# Altium project ProyectoMulticapa.PrjPcb (part 2 of 3)

## Sheet [4] Power Management.SchDoc
size Letter; Author: Ángel O. , Victor V.; DocumentNumber: 4; Revision: 1.0; SheetNumber: 4; SheetTotal: 6
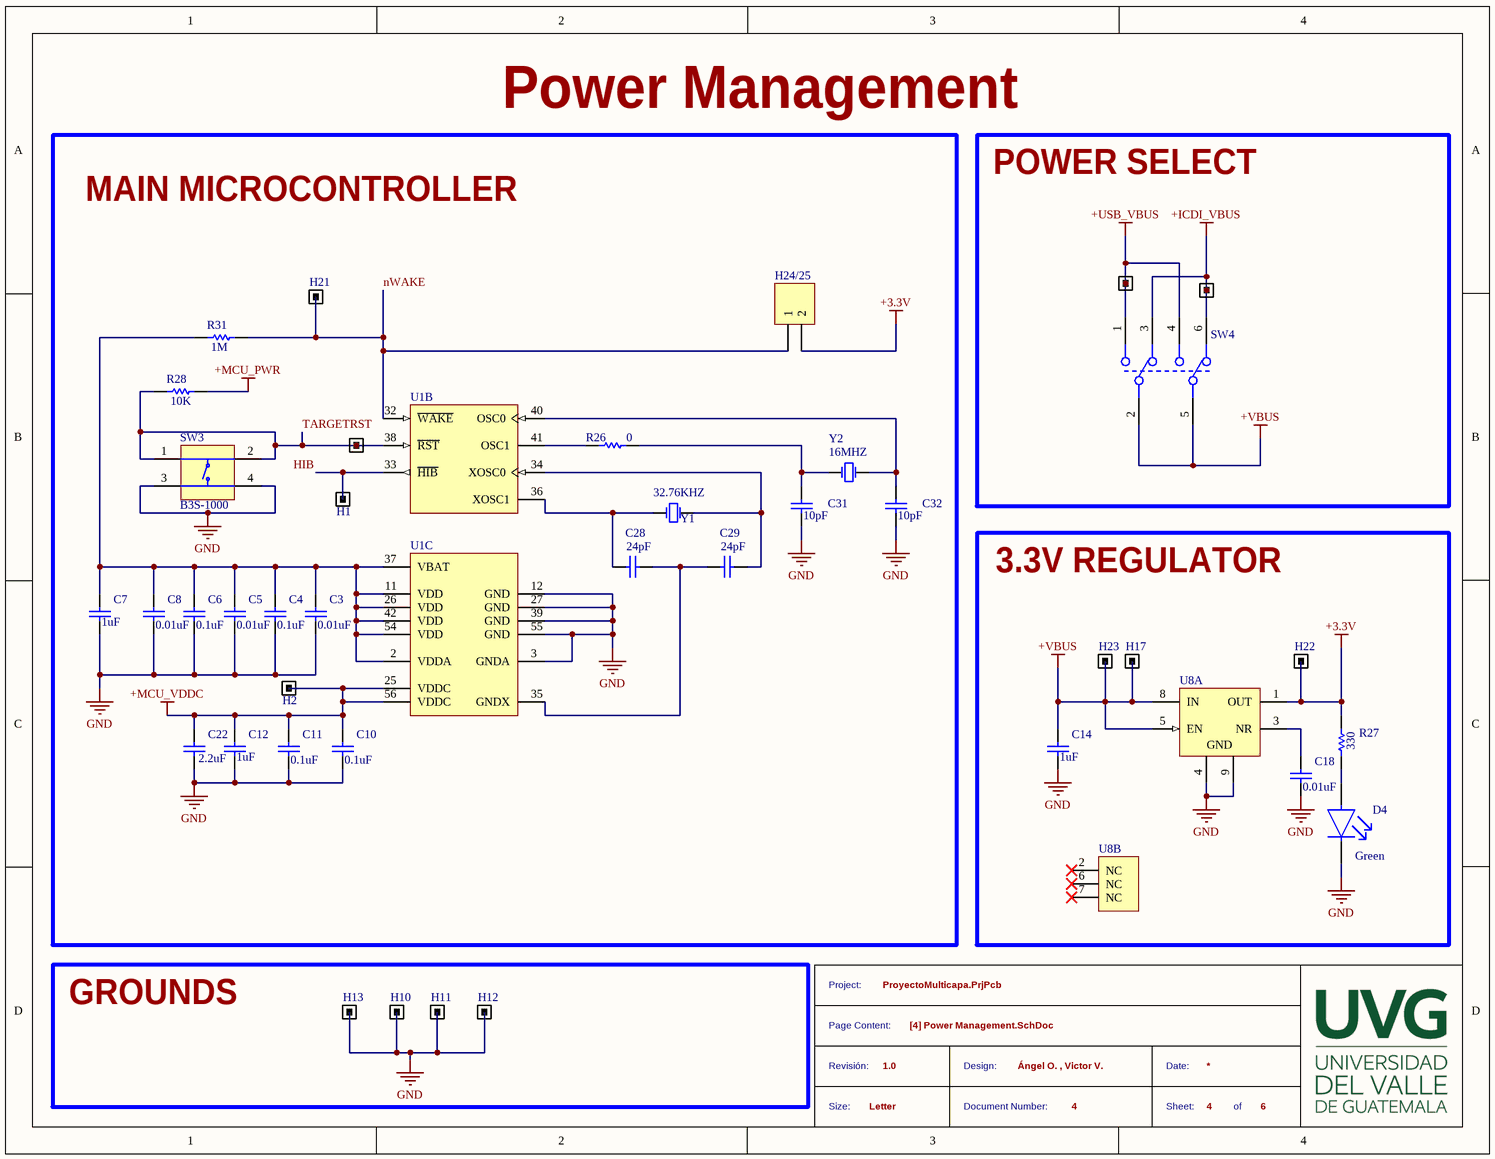
[diagram p4: [4] Power Management.SchDoc]

### Parts
C3  EMK105B7103KV-F  [CAPC1005]  (value not drawn)
C4  EMK105B7104KV-F  [CAPC1005]  (value not drawn)
C5  EMK105B7103KV-F  [CAPC1005]  (value not drawn)
C6  EMK105B7104KV-F  [CAPC1005]  (value not drawn)
C7  capacitor Johanson Dielectrics Inc  [C0402 imperial]  (value not drawn)
C8  EMK105B7103KV-F  [CAPC1005]  (value not drawn)
C10  EMK105B7104KV-F  [CAPC1005]  (value not drawn)
C11  EMK105B7104KV-F  [CAPC1005]  (value not drawn)
C12  capacitor Johanson Dielectrics Inc  [C0402 imperial]  (value not drawn)
C14  capacitor Johanson Dielectrics Inc  [C0402 imperial]  (value not drawn)
C18  EMK105B7103KV-F  [CAPC1005]  (value not drawn)
C22  GRM188R61C225KE15D  [CAPC1608X90X35LL10T15]  (value not drawn)
C28  Capacitor  [C0402 imperial]  (value not drawn)
C29  Capacitor  [C0402 imperial]  (value not drawn)
C31  GRM1555C1H100JZ01D  [CAPC1005X55X25LL05T10]  (value not drawn)
C32  GRM1555C1H100JZ01D  [CAPC1005X55X25LL05T10]  (value not drawn)
D4  Green  [FP-LTST-C171GKT-MFG]
H1  header  [HEADER 1]  (value not drawn)
H2  header  [HEADER 1]  (value not drawn)
H10  header  [HEADER 1]  (value not drawn)
H11  header  [HEADER 1]  (value not drawn)
H12  header  [HEADER 1]  (value not drawn)
H13  header  [HEADER 1]  (value not drawn)
H17  header  [HEADER 1]  (value not drawn)
H18  header  [HEADER 1]  (value not drawn)
H19  header  [HEADER 1]  (value not drawn)
H20  header  [HEADER 1]  (value not drawn)
H21  header  [HEADER 1]  (value not drawn)
H22  header  [HEADER 1]  (value not drawn)
H23  header  [HEADER 1]  (value not drawn)
H24/25  Header 2  [HDR1X2]  (value not drawn)
R26  ERJ-3GEY0R00V  [FP-ERJ-3GEY0R00V-IPC_A]  (value not drawn)
R27  RC0402FR-07330RL  [RESC1005X40X25LL05T10]  (value not drawn)
R28  RC0402FR-0710KL  [RESC1005X40X25LL05T10]  (value not drawn)
R31  MCR01MRTF1004  [RESC1005X40X25LL05T10]  (value not drawn)
SW3  B3S-1000  [OMRON-B3S-1000-4_V]
SW4  JS202011SCQN  [FP-JS202011SCQN-MFG]  (value not drawn)
U1  TM4C123GH6PMIR  [PM0064A_L]  (value not drawn)  (parts B,C of 3)
U8  TPS73633DRBT  [DRB0008A_V]  (value not drawn)  (parts A,B of 2)
Y1  AB26TRB-32.768KHZ-T  [AB26TRB]  (value not drawn)
Y2  NX5032GA-16.000000MHZ  [NX5032GA16000000MHZLNCD1]  (value not drawn)

### Blocks framed on the sheet
MAIN MICROCONTROLLER: C3-C8 C10-C12 C22 C28 C29 C31 C32 H1 H2 H20 H21 H24/25 R26 R28 R31 SW3 U1 Y1 Y2
POWER SELECT: H18 H19 SW4
3.3V REGULATOR: C14 C18 D4 H17 H22 H23 R27 U8
GROUNDS: H10-H13

### Nets
+3.3V: H22.1 H24/25.2 R27.2 U8.1(OUT)
+ICDI_VBUS: H19.1 SW4.3 SW4.6
+MCU_PWR: R28.2
+MCU_VDDC: C10.1 C11.1 C12.1 C22.1 H2.1 U1.25(VDDC) U1.56(VDDC)
+USB_VBUS: H18.1 SW4.1 SW4.4
+VBUS: C14.1 H17.1 H23.1 SW4.2 SW4.5 U8.5(EN) U8.8(IN)
GND: C3.2 C4.2 C5.2 C6.2 C7.2 C8.2 C10.2 C11.2 C12.2 C14.2 C18.2 C22.2 C31.2 C32.2 D4.1(C) H10.1 H11.1 H12.1 H13.1 SW3.3 SW3.4 U1.3(GNDA) U1.12(GND) U1.27(GND) U1.39(GND) U1.55(GND) U8.4(GND) U8.9(GND)
HIB: H1.1 U1.33(~{HIB})
nWAKE: H21.1 H24/25.1 R31.2 U1.32(~{WAKE})
TARGETRST: H20.1 R28.1 SW3.1 SW3.2 U1.38(~{RST})
NetC3_1: C3.1 C4.1 C5.1 C6.1 C7.1 C8.1 R31.1 U1.2(VDDA) U1.11(VDD) U1.26(VDD) U1.37(VBAT) U1.42(VDD) U1.54(VDD)
NetC18_1: C18.1 U8.3(NR)
NetC28_1: C28.1 U1.36(XOSC1) Y1.1
NetC28_2: C28.2 C29.1 U1.35(GNDX)
NetC29_2: C29.2 U1.34(XOSC0) Y1.2
NetC31_1: C31.1 R26.2 Y2.1
NetC32_1: C32.1 U1.40(OSC0) Y2.2
NetD4_2: D4.2(A) R27.1
NetR26_1: R26.1 U1.41(OSC1)

Not connected (* = marked no-connect by the designer): U8 2(NC)* 6(NC)* 7(NC)*

### Notes on the sheet
- Power Management
- Project:
- Page Content:
- Revisión:
- Size:
- Letter
- Design:
- Document Number:
- Date:
- Sheet:
- of
- (in symbol AB26TRB-32.768KHZ-T) 32.76KHZ
- (in symbol EMK105B7103KV-F) 0.01uF
- (in symbol EMK105B7104KV-F) 0.1uF
- (in symbol ERJ-3GEY0R00V) 0
- (in symbol MCR01MRTF1004) 1M
- (in symbol NX5032GA-16.000000MHZ) 16MHZ
- (in symbol RC0402FR-0710KL) 10K
- (in symbol RC0402FR-07330RL) 330

### Library data of the parts
C3 C5 C8 C18 = EMK105B7103KV-F: TAIYO YUDEN   EMK105B7103KV-F   CERAMIC CAPACITOR, 0.01UF, 16V, X7R, 10%, 0402, FULL REEL; Capacitance: 10nF; Supplier 1: Digi-Key; Manufacturer: Taiyo Yuden; Manufacturer Part Number: EMK105B7103KV-F; Stock 1: 171674; Pricing 1: 1 = 0.10000, 10 = 0.02500, 50 = 0.01380, 100 = 0.01130, 500 = 0.00804, 1000 = 0.00632, 2500 = 0.00575, 5000 = 0.00529 (USD); RoHS: Yes; Mount: Surface Mount; Case/Package: 0402; Number of Pins: 2; Case Code (Metric): 1005; Case Code (Imperial): 0402; Contact Plating: Tin; Min Operating Temperature: -55°C; Max Operating Temperature: 125°C; Package Quantity: 1; Voltage Rating: 16V; Tolerance: 10%; Packaging: Tape and Reel; Voltage Rating (DC): 16V; Dielectric: X7R; Termination: SMD/SMT; Series: M; Construction: Flat; Resistor Type: Ceramic; Length: 1mm; Width: 0.02inch; Height: 0.5mm; Thickness: 0.022inch; Depth: 0.5mm; Radiation Hardening: No; REACH SVHC: Unknown; RoHS Compliant: Yes; ComponentLink1URL: https://datasheet.ciiva.com/156/mlcc-all-e-156078.pdf?src-supplier=Digi-Key; ComponentLink1Description: https://datasheet.ciiva.com/156/mlcc-all-e-156078.pdf?src-supplier=Digi-Key; ComponentLink2URL: https://datasheet.ciiva.com/156/mlcc-all-e-156079.pdf?src-supplier=Digi-Key; ComponentLink2Description: https://datasheet.ciiva.com/156/mlcc-all-e-156079.pdf?src-supplier=Digi-Key; ComponentLink3URL: https://datasheet.ciiva.com/156/mlcc-all-e-156080.pdf?src-supplier=Digi-Key; ComponentLink3Description: https://datasheet.ciiva.com/156/mlcc-all-e-156080.pdf?src-supplier=Digi-Key; ComponentLink4URL: https://datasheet.ciiva.com/11596/mlcc01-e-11596553.pdf?src-supplier=Avnet; ComponentLink4Description: https://datasheet.ciiva.com/11596/mlcc01-e-11596553.pdf?src-supplier=Avnet; ComponentLink5URL: https://datasheet.ciiva.com/28644/746258-28644943.pdf?src-supplier=Element14; ComponentLink5Description: https://datasheet.ciiva.com/28644/746258-28644943.pdf?src-supplier=Element14; ComponentLink6URL: https://datasheet.ciiva.com/7975/1481447-7975594.pdf?src-supplier=Element14; ComponentLink6Description: https://datasheet.ciiva.com/7975/1481447-7975594.pdf?src-supplier=Element14; Supplier Part Number 1: 587-2708-1-ND
C4 C6 C10 C11 = EMK105B7104KV-F: TAIYO YUDEN - EMK105B7104KV-F - SMD Multilayer Ceramic Capacitor, 0.1 &#181;F, 16 V, 0402 [1005 Metric], &#177; 10%, X7R, M Series; Capacitance: 100nF; Voltage Rating (DC): 16V; Supplier 1: Digi-Key; Manufacturer: Taiyo Yuden; Manufacturer Part Number: EMK105B7104KV-F; Stock 1: 5046270; Pricing 1: 1 = 0.10000, 10 = 0.02400, 50 = 0.01320, 100 = 0.01070, 500 = 0.00764, 1000 = 0.00601, 2500 = 0.00546, 5000 = 0.00503 (USD); RoHS: Yes; Mount: Surface Mount; Case/Package: 0402; Number of Pins: 2; Case Code (Metric): 1005; Case Code (Imperial): 0402; Min Operating Temperature: -55°C; Max Operating Temperature: 125°C; Tolerance: 10%; Packaging: Tape and Reel; Dielectric: X7R; Package Quantity: 1; Voltage Rating: 16V; Termination: SMD/SMT; Series: M; Construction: Flat; Resistor Type: Ceramic; Length: 1mm; Width: 0.02inch; Height: 0.5mm; Thickness: 0.022inch; Depth: 0.5mm; Radiation Hardening: No; Halogen Free: Halogen Free; REACH SVHC: Unknown; RoHS Compliant: Yes; Lead Free: Lead Free; ComponentLink1URL: https://datasheet.ciiva.com/129/emk105b7104kv-f-ss-129714.pdf?src-supplier=Digi-Key; ComponentLink1Description: https://datasheet.ciiva.com/129/emk105b7104kv-f-ss-129714.pdf?src-supplier=Digi-Key; ComponentLink2URL: https://datasheet.ciiva.com/30227/emk105b7104kv-f-30227394.pdf?src-supplier=Onlinecomponents.com; ComponentLink2Description: https://datasheet.ciiva.com/30227/emk105b7104kv-f-30227394.pdf?src-supplier=Onlinecomponents.com; ComponentLink3URL: https://datasheet.ciiva.com/22748/746258-22748959.pdf?src-supplier=Element14; ComponentLink3Description: https://datasheet.ciiva.com/22748/746258-22748959.pdf?src-supplier=Element14; Supplier Part Number 1: 587-1451-1-ND
C7 C12 C14 = 100R07X105KV4T: Cap Ceramic 1uF 10V X5R 10% SMD 0402 85C T/R; Supplier 1: Mouser; Manufacturer: Johanson; Manufacturer Part Number: 100R07X105KV4T; Stock 1: 173156; Pricing 1: 1 = 0.26000, 10 = 0.13400, 50 = 0.13400, 100 = 0.07600, 1000 = 0.04900, 10000 = 0.04000 (USD); RoHS: Yes; Mount: Surface Mount; Case/Package: 0402; Number of Pins: 2; Case Code (Metric): 1005; Case Code (Imperial): 0402; Weight: 2.3E-05oz; Min Operating Temperature: -55°C; Max Operating Temperature: 85°C; Capacitance: 1uF; Tolerance: 10%; Voltage Rating: 10V; Packaging: Tape and Reel; Package Quantity: 10000; Voltage Rating (DC): 10V; Dielectric: X5R; Termination: SMD/SMT; Series: TANCERAM®; Length: 1.02mm; Width: 0.02inch; Height: 0.64mm; Thickness: 0.025inch; Depth: 0.51mm; Radiation Hardening: No; REACH SVHC: No SVHC; RoHS Compliant: Yes; ComponentLink1URL: https://datasheet.ciiva.com/26948/getdatasheetpartid-789067-26948543.pdf?src-supplier=Verical; ComponentLink1Description: https://datasheet.ciiva.com/26948/getdatasheetpartid-789067-26948543.pdf?src-supplier=Verical; ComponentLink2URL: https://datasheet.ciiva.com/22693/jdi-full-catalog-2012-01-22693744.pdf?src-supplier=Element14; ComponentLink2Description: https://datasheet.ciiva.com/22693/jdi-full-catalog-2012-01-22693744.pdf?src-supplier=Element14; Supplier Part Number 1: 605-100R07X105KV4T
C22 = GRM188R61C225KE15D: Cap Ceramic 2.2uF 16V X5R 10% SMD 0603 85C Paper T/R; Manufacturer: Murata; Supplier 1: Farnell; Manufacturer Part Number: GRM188R61C225KE15D; Stock 1: 0; Pricing 1: 10 = 0.13600, 100 = 0.08010, 500 = 0.05040, 1000 = 0.04260, 2000 = 0.03240 (GBP); RoHS: Yes; Mount: Surface Mount; Case/Package: 0603; Case Code (Imperial): 0603; Case Code (Metric): 1608; Material: Ceramic; Min Operating Temperature: -55°C; Max Operating Temperature: 85°C; Capacitance: 2.2uF; Tolerance: 10%; Dielectric: X5R; Voltage Rating: 16V; Voltage Rating (DC): 16V; Packaging: Tape and Reel; Package Quantity: 1; Termination: SMD/SMT; Voltage: 16V; Length: 1.6mm; Width: 0.8mm; Height: 0.8mm; Thickness: 0.035inch; Depth: 0.8mm; Radiation Hardening: No; RoHS Compliant: Yes; Lead Free: Lead Free; REACH SVHC: No SVHC; ComponentLink1URL: https://datasheet.ciiva.com/135/grm188r61c225ke15-01-135062.pdf?src-supplier=Digi-Key; ComponentLink1Description: https://datasheet.ciiva.com/135/grm188r61c225ke15-01-135062.pdf?src-supplier=Digi-Key; ComponentLink2URL: https://datasheet.ciiva.com/135/grm188r61c225ke15-01-135063.pdf?src-supplier=Digi-Key; ComponentLink2Description: https://datasheet.ciiva.com/135/grm188r61c225ke15-01-135063.pdf?src-supplier=Digi-Key; ComponentLink3URL: https://datasheet.ciiva.com/5417/product-5417088.pdf?src-supplier=Mouser; ComponentLink3Description: https://datasheet.ciiva.com/5417/product-5417088.pdf?src-supplier=Mouser; ComponentLink4URL: https://datasheet.ciiva.com/3777/147grm188r61c225ke1523-3777042.pdf?src-supplier=Arrow+Electronics; ComponentLink4Description: https://datasheet.ciiva.com/3777/147grm188r61c225ke1523-3777042.pdf?src-supplier=Arrow+Electronics; ComponentLink5URL: https://datasheet.ciiva.com/29199/454457-da-01-en-vs-kondensator-0603-29199689.pdf?src-supplier=Conrad; ComponentLink5Description: https://datasheet.ciiva.com/29199/454457-da-01-en-vs-kondensator-0603-29199689.pdf?src-supplier=Conrad; ComponentLink6URL: https://datasheet.ciiva.com/135/grm188r61c225ke15-01-135061.pdf?src-supplier=Digi-Key; ComponentLink6Description: https://datasheet.ciiva.com/135/grm188r61c225ke15-01-135061.pdf?src-supplier=Digi-Key; ComponentLink7URL: https://datasheet.ciiva.com/16369/product-16369274.pdf?src-supplier=Future+Electronics; ComponentLink7Description: https://datasheet.ciiva.com/16369/product-16369274.pdf?src-supplier=Future+Electronics; Supplier Part Number 1: 1735526
C28 C29 = C1005C0G1H240J: CAP CER 24PF 50V C0G 0402; Manufacturer: TDK; Dielectric Material: Ceramic; Tolerance: 5%; Supplier 1: Newark; Manufacturer Part Number: C1005C0G1H240J; Stock 1: 0; RoHS: Yes; Mount: Surface Mount; Case/Package: 0402; Number of Pins: 2; Case Code (Metric): 1005; Case Code (Imperial): 0402; Min Operating Temperature: -55°C; Max Operating Temperature: 125°C; Package Quantity: 1; Capacitance: 24pF; Voltage Rating: 50V; Packaging: Tape and Reel; Voltage Rating (DC): 50V; Dielectric: C0G; Termination: SMD/SMT; Resistor Type: Ceramic; Series: C; Construction: Flat; Length: 0.039inch; Width: 0.02inch; Height: 0.5mm; Thickness: 0.022inch; ComponentLink1URL: https://datasheet.ciiva.com/161/c-series-generalappl-b11-161778.pdf?src-supplier=Digi-Key; ComponentLink1Description: https://datasheet.ciiva.com/161/c-series-generalappl-b11-161778.pdf?src-supplier=Digi-Key; ComponentLink2URL: https://datasheet.ciiva.com/161/c-series-generalappl-b11-161779.pdf?src-supplier=Digi-Key; ComponentLink2Description: https://datasheet.ciiva.com/161/c-series-generalappl-b11-161779.pdf?src-supplier=Digi-Key; ComponentLink3URL: https://datasheet.ciiva.com/161/c-series-generalappl-b11-161780.pdf?src-supplier=Digi-Key; ComponentLink3Description: https://datasheet.ciiva.com/161/c-series-generalappl-b11-161780.pdf?src-supplier=Digi-Key; ComponentLink4URL: https://datasheet.ciiva.com/5418/mlcc-commercial-general-en-5418382.pdf?src-supplier=Mouser; ComponentLink4Description: https://datasheet.ciiva.com/5418/mlcc-commercial-general-en-5418382.pdf?src-supplier=Mouser; Supplier Part Number 1: 87R3204
C31 C32 = GRM1555C1H100JZ01D: CAP, CERAMIC, 10PF, 50V, C0G/NP0, 0402; Manufacturer: Murata; Tolerance: 5%; Dielectric: C0G; Insulation Resistance: 10GR; Temperature Coefficient: 30ppm/°C; Supplier 1: Farnell; Manufacturer Part Number: GRM1555C1H100JZ01D; Stock 1: 0; Pricing 1: 1 = 37.68000, 3 = 28.53000 (GBP); RoHS: Yes; Mount: Surface Mount; Case/Package: 0402; Number of Pins: 2; Case Code (Imperial): 0402; Case Code (Metric): 1005; Dielectric Material: Ceramic; Min Operating Temperature: -55°C; Max Operating Temperature: 125°C; Capacitance: 10pF; Voltage Rating: 50V; Voltage Rating (DC): 50V; Packaging: Tape and Reel; Package Quantity: 1; Termination: SMD/SMT; Voltage: 50V; Series: GRM; Construction: Flat; Length: 1mm; Width: 0.5mm; Height: 0.5mm; Thickness: 0.022inch; Depth: 0.5mm; Size: 0.5mm; Radiation Hardening: No; REACH SVHC: No SVHC; Lead Free: Lead Free; RoHS Compliant: Yes; ComponentLink1URL: https://datasheet.ciiva.com/129/partnumbering-e-01-129819.pdf?src-supplier=Digi-Key; ComponentLink1Description: https://datasheet.ciiva.com/129/partnumbering-e-01-129819.pdf?src-supplier=Digi-Key; ComponentLink2URL: https://datasheet.ciiva.com/129/partnumbering-e-01-129820.pdf?src-supplier=Digi-Key; ComponentLink2Description: https://datasheet.ciiva.com/129/partnumbering-e-01-129820.pdf?src-supplier=Digi-Key; ComponentLink3URL: https://datasheet.ciiva.com/129/partnumbering-e-01-129821.pdf?src-supplier=Digi-Key; ComponentLink3Description: https://datasheet.ciiva.com/129/partnumbering-e-01-129821.pdf?src-supplier=Digi-Key; ComponentLink4URL: https://datasheet.ciiva.com/19476/1855887-19476237.pdf?src-supplier=Jameco; ComponentLink4Description: https://datasheet.ciiva.com/19476/1855887-19476237.pdf?src-supplier=Jameco; ComponentLink5URL: https://datasheet.ciiva.com/18184/getdatasheetpartid-91958-18184166.pdf?src-supplier=Verical; ComponentLink5Description: https://datasheet.ciiva.com/18184/getdatasheetpartid-91958-18184166.pdf?src-supplier=Verical; ComponentLink6URL: https://datasheet.ciiva.com/11787/0900766b807a1cab-11787097.pdf?src-supplier=RSComponents; ComponentLink6Description: https://datasheet.ciiva.com/11787/0900766b807a1cab-11787097.pdf?src-supplier=RSComponents; ComponentLink7URL: https://datasheet.ciiva.com/6068/1747431-6068159.pdf?src-supplier=Farnell; ComponentLink7Description: https://datasheet.ciiva.com/6068/1747431-6068159.pdf?src-supplier=Farnell; ComponentLink8URL: https://datasheet.ciiva.com/11607/c02e-11607480.pdf?src-supplier=Avnet; ComponentLink8Description: https://datasheet.ciiva.com/11607/c02e-11607480.pdf?src-supplier=Avnet; ComponentLink9URL: https://datasheet.ciiva.com/14116/grmseries-tc-hitype-eng-14116856.pdf?src-supplier=Distrelec; ComponentLink9Description: https://datasheet.ciiva.com/14116/grmseries-tc-hitype-eng-14116856.pdf?src-supplier=Distrelec; ComponentLink10URL: https://datasheet.ciiva.com/14116/grmseries-tc-hitype-eng-14116917.pdf?src-supplier=Distrelec; ComponentLink10Description: https://datasheet.ciiva.com/14116/grmseries-tc-hitype-eng-14116917.pdf?src-supplier=Distrelec; ComponentLink11URL: https://datasheet.ciiva.com/7828/1747431-7828813.pdf?src-supplier=Element14; ComponentLink11Description: https://datasheet.ciiva.com/7828/1747431-7828813.pdf?src-supplier=Element14; ComponentLink12URL: https://datasheet.ciiva.com/7828/1747431-7828815.pdf?src-supplier=Element14; ComponentLink12Description: https://datasheet.ciiva.com/7828/1747431-7828815.pdf?src-supplier=Element14; Supplier Part Number 1: 1118131
D4 = LTST-C171GKT: LED GREEN CLEAR CHIP SMD; Manufacturer: Vishay Lite-On; Luminous Intensity: 12mcd; Lens Color: Colorless; Dominant Wavelength: 569nm; Number of LEDs: 1; Power Dissipation: 100mW; Viewing Angle: 130°; Reverse Voltage: 5V; Test Current: 10mA; Forward Voltage: 2.1V; Wavelength: 585nm; Lens Style: Diffused; Forward Current: 30mA; Height: 0.8mm; Mount: Surface Mount; Package Quantity: 1; Length: 2mm; Case Code (Metric): 2012; Number of Pins: 2; Number of Elements: 1; Packaging: Tape and Reel; Color: Green; Min Operating Temperature: -55°C; Case/Package: 0805; Power Rating: 100mW; Max Operating Temperature: 85°C; Radiation Hardening: No; Depth: 1.25mm; Lens Transparency: Clear; Width: 1.25mm; Lead Free: Lead Free; Case Code (Imperial): 0805; Illumination Color: Green; Supplier 1: Digi-Key; Manufacturer Part Number: LTST-C171GKT; Stock 1: 10; Pricing 1: 1 = 0.26000, 10 = 0.14100, 100 = 0.06560, 500 = 0.06060, 1000 = 0.04747 (USD); RoHS: Yes; Series: CHIPLED 0805; RoHS Compliant: Yes; ComponentLink1URL: https://datasheet.ciiva.com/12400/lite-on-ltst-c171gkt-190133-12400647.pdf?src-supplier=Mouser; ComponentLink1Description: https://datasheet.ciiva.com/12400/lite-on-ltst-c171gkt-190133-12400647.pdf?src-supplier=Mouser; ComponentLink2URL: https://datasheet.ciiva.com/2110/ltst-c171gkt-2110000.pdf?src-supplier=Digi-Key; ComponentLink2Description: https://datasheet.ciiva.com/2110/ltst-c171gkt-2110000.pdf?src-supplier=Digi-Key; ComponentLink3URL: https://datasheet.ciiva.com/11773/0900766b80dc0296-11773991.pdf?src-supplier=RSComponents; ComponentLink3Description: https://datasheet.ciiva.com/11773/0900766b80dc0296-11773991.pdf?src-supplier=RSComponents; ComponentLink4URL: https://datasheet.ciiva.com/2110/ltst-c171gkt-2110001.pdf?src-supplier=Digi-Key; ComponentLink4Description: https://datasheet.ciiva.com/2110/ltst-c171gkt-2110001.pdf?src-supplier=Digi-Key; ComponentLink5URL: https://datasheet.ciiva.com/2110/ltst-c171gkt-2110002.pdf?src-supplier=Digi-Key; ComponentLink5Description: https://datasheet.ciiva.com/2110/ltst-c171gkt-2110002.pdf?src-supplier=Digi-Key; ComponentLink6URL: https://datasheet.ciiva.com/16396/ltst-c171gkt-16396549.pdf?src-supplier=Future+Electronics; ComponentLink6Description: https://datasheet.ciiva.com/16396/ltst-c171gkt-16396549.pdf?src-supplier=Future+Electronics; Supplier Part Number 1: 160-1423-1-ND
H1 H2 H10-H13 H17-H23 = header: Pads header que aparecen en la tiva
H24/25 = Header 2: Header, 2-Pin; LatestRevisionDate: 17-Jul-2002; LatestRevisionNote: Re-released for DXP Platform.; Publisher: Altium Limited
R26 = ERJ-3GEY0R00V: Res Thick Film 0603 0 Ohm Jumper Molded SMD Punched Carrier T/R; Manufacturer: Panasonic; Resistance: 0R; Power Rating: 100mW; Voltage Rating: 75V; Tolerance: 0%; Temperature Coefficient: 600ppm/°C; Voltage Rating (DC): 50V; Supplier 1: Future Electronics; Manufacturer Part Number: ERJ-3GEY0R00V; Stock 1: 910317; Pricing 1: 1 = 0.01920, 50 = 0.01640, 100 = 0.01600, 500 = 0.01500, 1500 = 0.01440 (USD); RoHS: Yes; Mount: Surface Mount; Case/Package: 0603; Contact Plating: Tin; Case Code (Metric): 1608; Case Code (Imperial): 0603; Size Code: 0603; Min Operating Temperature: -55°C; Max Operating Temperature: 155°C; Resistor Type: Thick Film; Packaging: Tape and Reel; Package Quantity: 1; Number of Terminations: 2; Termination: SMD/SMT; Max Power Dissipation: 100mW; Features: Automotive AEC-Q200; Series: ERJ; Construction: Rectangular; Technology: THICK FILM; Length: 1.6mm; Width: 0.031inch; Height: 0.45mm; Depth: 0.8mm; Radiation Hardening: No; REACH SVHC: No SVHC; Military Standard: Not; Lead Free: Lead Free; RoHS Compliant: Yes; ComponentLink1URL: https://datasheet.ciiva.com/11808/0900766b80f806dd-11808207.pdf?src-supplier=RSComponents; ComponentLink1Description: https://datasheet.ciiva.com/11808/0900766b80f806dd-11808207.pdf?src-supplier=RSComponents; ComponentLink2URL: https://datasheet.ciiva.com/27055/1935748-27055113.pdf?src-supplier=Jameco; ComponentLink2Description: https://datasheet.ciiva.com/27055/1935748-27055113.pdf?src-supplier=Jameco; ComponentLink3URL: https://datasheet.ciiva.com/48532/aoa0000ce1-48532165.pdf?src-supplier=Avnet; ComponentLink3Description: https://datasheet.ciiva.com/48532/aoa0000ce1-48532165.pdf?src-supplier=Avnet; ComponentLink4URL: https://datasheet.ciiva.com/5959/1678796-5959707.pdf?src-supplier=Farnell; ComponentLink4Description: https://datasheet.ciiva.com/5959/1678796-5959707.pdf?src-supplier=Farnell; ComponentLink5URL: https://datasheet.ciiva.com/43460/1678796-43460647.pdf?src-supplier=Farnell; ComponentLink5Description: https://datasheet.ciiva.com/43460/1678796-43460647.pdf?src-supplier=Farnell; ComponentLink6URL: https://datasheet.ciiva.com/9198/aoa0000ce1-9198975.pdf?src-supplier=Avnet; ComponentLink6Description: https://datasheet.ciiva.com/9198/aoa0000ce1-9198975.pdf?src-supplier=Avnet; ComponentLink7URL: https://datasheet.ciiva.com/30199/4aoa0000ce1-30199822.pdf?src-supplier=Onlinecomponents.com; ComponentLink7Description: https://datasheet.ciiva.com/30199/4aoa0000ce1-30199822.pdf?src-supplier=Onlinecomponents.com; ComponentLink8URL: https://datasheet.ciiva.com/16758/70255313-16758527.pdf?src-supplier=Allied+Electronics; ComponentLink8Description: https://datasheet.ciiva.com/16758/70255313-16758527.pdf?src-supplier=Allied+Electronics; ComponentLink9URL: https://datasheet.ciiva.com/16834/aoa0000ce1-16834828.pdf?src-supplier=Future+Electronics; ComponentLink9Description: https://datasheet.ciiva.com/16834/aoa0000ce1-16834828.pdf?src-supplier=Future+Electronics; ComponentLink10URL: https://datasheet.ciiva.com/46377/1678796-46377868.pdf?src-supplier=Element14; ComponentLink10Description: https://datasheet.ciiva.com/46377/1678796-46377868.pdf?src-supplier=Element14; ComponentLink11URL: https://datasheet.ciiva.com/28695/1678796-28695833.pdf?src-supplier=Element14; ComponentLink11Description: https://datasheet.ciiva.com/28695/1678796-28695833.pdf?src-supplier=Element14; ComponentLink12URL: https://datasheet.ciiva.com/17215/aoa0000ce1-17215388.pdf?src-supplier=Avnet+Europe; ComponentLink12Description: https://datasheet.ciiva.com/17215/aoa0000ce1-17215388.pdf?src-supplier=Avnet+Europe; Supplier Part Number 1: 4103908
R27 = RC0402FR-07330RL: Res Thick Film 0402 330 Ohm 1% 0.063W(1/16W) ±100ppm/C Pad SMD T/R; Manufacturer: Yageo / Phycomp; Resistance: 330R; Temperature Coefficient: 100ppm/°C; Power Rating: 62.5mW; Voltage Rating: 50V; Max Power Dissipation: 63mW; Part Number: RC0402FR-07330RL; Supplier 1: Future Electronics; Manufacturer Part Number: RC0402FR-07330RL; Stock 1: 814184; Pricing 1: 1 = 0.00590, 500 = 0.00300, 1500 = 0.00260, 2500 = 0.00250, 5000 = 0.00230 (USD); RoHS: Yes; Case/Package: 0402; Case Code (Metric): 1005; Case Code (Imperial): 0402; Size Code: 0402; Min Operating Temperature: -55°C; Max Operating Temperature: 155°C; Packaging: Tape and Reel; Tolerance: 1%; Package Quantity: 1; Resistor Type: Thick Film; Number of Terminations: 2; Termination: SMD/SMT; Features: Moisture Resistant; Series: RC; Construction: Rectangular; Technology: THICK FILM; Resistance Tolerance: 1%; Length: 0.039inch; Width: 0.02inch; Height: 0.016inch; Depth: 0.5mm; RoHS Compliant: Yes; REACH SVHC: Unknown; Military Standard: Not; Lead Free: Lead Free; ComponentLink1URL: https://datasheet.ciiva.com/11819/0900766b80c66297-11819490.pdf?src-supplier=RSComponents; ComponentLink1Description: https://datasheet.ciiva.com/11819/0900766b80c66297-11819490.pdf?src-supplier=RSComponents; ComponentLink2URL: https://datasheet.ciiva.com/12656/pyu-rc0402-51-rohs-l-6-r-12656815.pdf?src-supplier=Mouser; ComponentLink2Description: https://datasheet.ciiva.com/12656/pyu-rc0402-51-rohs-l-6-r-12656815.pdf?src-supplier=Mouser; ComponentLink3URL: https://datasheet.ciiva.com/2453/pyu-r-int-thick-7-2453661.pdf?src-supplier=Digi-Key; ComponentLink3Description: https://datasheet.ciiva.com/2453/pyu-r-int-thick-7-2453661.pdf?src-supplier=Digi-Key; ComponentLink4URL: https://datasheet.ciiva.com/2453/pyu-r-int-thick-7-2453662.pdf?src-supplier=Digi-Key; ComponentLink4Description: https://datasheet.ciiva.com/2453/pyu-r-int-thick-7-2453662.pdf?src-supplier=Digi-Key; ComponentLink5URL: https://datasheet.ciiva.com/2453/pyu-r-int-thick-7-2453663.pdf?src-supplier=Digi-Key; ComponentLink5Description: https://datasheet.ciiva.com/2453/pyu-r-int-thick-7-2453663.pdf?src-supplier=Digi-Key; ComponentLink6URL: https://datasheet.ciiva.com/7849/1018594-7849962.pdf?src-supplier=Element14; ComponentLink6Description: https://datasheet.ciiva.com/7849/1018594-7849962.pdf?src-supplier=Element14; ComponentLink7URL: https://datasheet.ciiva.com/7849/1018594-7849963.pdf?src-supplier=Element14; ComponentLink7Description: https://datasheet.ciiva.com/7849/1018594-7849963.pdf?src-supplier=Element14; ComponentLink8URL: https://datasheet.ciiva.com/17083/pyu-rc0402-51-rohs-l-6-r-17083994.pdf?src-supplier=Future+Electronics; ComponentLink8Description: https://datasheet.ciiva.com/17083/pyu-rc0402-51-rohs-l-6-r-17083994.pdf?src-supplier=Future+Electronics; Supplier Part Number 1: 6023220
R28 = RC0402FR-0710KL: Surface Mount Thick Film Resistor, Rc Series, 10 Kohm, 62.5 Mw, - 1%, 50 V, 0402 [1005 Metric]; Manufacturer: Yageo; Resistance: 10kR; Temperature Coefficient: 100ppm/°C; Voltage Rating (DC): 50V; Power Rating: 62.5mW; Max Power Dissipation: 63mW; Supplier 1: Digi-Key; Manufacturer Part Number: RC0402FR-0710KL; Stock 1: 6227591; Pricing 1: 1 = 0.10000, 10 = 0.01600, 100 = 0.00660, 1000 = 0.00299, 2500 = 0.00259, 5000 = 0.00214 (USD); RoHS: Yes; Case/Package: 0402; Number of Pins: 2; Case Code (Imperial): 0402; Case Code (Metric): 1005; Min Operating Temperature: -55°C; Max Operating Temperature: 155°C; Resistor Type: Thick Film; Tolerance: 1%; Packaging: Tape and Reel; Voltage Rating: 50V; Termination: SMD/SMT; Working Voltage: 50V; Number of Terminations: 2; Features: Moisture Resistant; Series: RC; Resistance Tolerance: 1%; Construction: Rectangular; Length: 1mm; Width: 0.5mm; Height: 0.32mm; Depth: 0.5mm; Lead Pitch: 0.2mm; REACH SVHC: No SVHC; Lead Free: Lead Free; RoHS Compliant: Yes; Military Standard: Not; ComponentLink1URL: https://datasheet.ciiva.com/7660/38568-7660787.pdf?src-supplier=Element14; ComponentLink1Description: https://datasheet.ciiva.com/7660/38568-7660787.pdf?src-supplier=Element14; ComponentLink2URL: https://datasheet.ciiva.com/12667/pyu-rc0402-51-rohs-l-6-r-12667067.pdf?src-supplier=Mouser; ComponentLink2Description: https://datasheet.ciiva.com/12667/pyu-rc0402-51-rohs-l-6-r-12667067.pdf?src-supplier=Mouser; ComponentLink3URL: https://datasheet.ciiva.com/7849/1784430-7849813.pdf?src-supplier=Element14; ComponentLink3Description: https://datasheet.ciiva.com/7849/1784430-7849813.pdf?src-supplier=Element14; ComponentLink4URL: https://datasheet.ciiva.com/7849/1686128-7849814.pdf?src-supplier=Element14; ComponentLink4Description: https://datasheet.ciiva.com/7849/1686128-7849814.pdf?src-supplier=Element14; ComponentLink5URL: https://datasheet.ciiva.com/7849/1784430-7849815.pdf?src-supplier=Element14; ComponentLink5Description: https://datasheet.ciiva.com/7849/1784430-7849815.pdf?src-supplier=Element14; ComponentLink6URL: https://datasheet.ciiva.com/7983/1018594-7983486.pdf?src-supplier=Element14; ComponentLink6Description: https://datasheet.ciiva.com/7983/1018594-7983486.pdf?src-supplier=Element14; ComponentLink7URL: https://datasheet.ciiva.com/22747/1018594-22747512.pdf?src-supplier=Element14; ComponentLink7Description: https://datasheet.ciiva.com/22747/1018594-22747512.pdf?src-supplier=Element14; Supplier Part Number 1: 311-10.0KLRCT-ND
R31 = MCR01MRTF1004: RES SMD 1M OHM 1% 1/16W 0402; Manufacturer: Rohm; Resistance: 1MR; Max Power Dissipation: 63mW; Temperature Coefficient: 100ppm/°C; Voltage Rating (DC): 50V; Supplier 1: Digi-Key; Manufacturer Part Number: MCR01MRTF1004; Stock 1: 0; RoHS: Yes; Case/Package: 0402; Case Code (Metric): 1005; Case Code (Imperial): 0402; Min Operating Temperature: -55°C; Max Operating Temperature: 155°C; Package Quantity: 1; Tolerance: 1%; Packaging: Tape and Reel; Resistor Type: Thick Film; Number of Terminations: 2; Series: MCR; Length: 0.039inch; Width: 0.02inch; Height: 0.016inch; Lead Free: Lead Free; RoHS Compliant: Yes; ComponentLink1URL: https://datasheet.ciiva.com/2519/mcr01mrt-seriesspec-2519945.pdf?src-supplier=Digi-Key; ComponentLink1Description: https://datasheet.ciiva.com/2519/mcr01mrt-seriesspec-2519945.pdf?src-supplier=Digi-Key; ComponentLink2URL: https://datasheet.ciiva.com/2519/mcr01mrt-seriesspec-2519946.pdf?src-supplier=Digi-Key; ComponentLink2Description: https://datasheet.ciiva.com/2519/mcr01mrt-seriesspec-2519946.pdf?src-supplier=Digi-Key; ComponentLink3URL: https://datasheet.ciiva.com/2519/mcr01mrt-seriesspec-2519947.pdf?src-supplier=Digi-Key; ComponentLink3Description: https://datasheet.ciiva.com/2519/mcr01mrt-seriesspec-2519947.pdf?src-supplier=Digi-Key; Supplier Part Number 1: RHM1.00MCDCT-ND
SW3 = B3S-1000: Sealed Tactile Switch, SPST-NO, 3 to 24 V, -25 to 70 degC, 4-Pin SMD, RoHS, Bulk; Manufacturer: Omron; Voltage Rating: 24 V; Current Rating: 50 mA; Contact Plating: Silver; ComponentLink1Description: Manufacturer URL; Packaging: Bulk; Package Quantity: 1500; Min Operating Temperature: -25 degC; Max Operating Temperature: 70 degC; REACH SVHC: No SVHC; ComponentLink1URL: http://www.omron.com/; RoHSCompliant: true; PackageDescription: 4-Pin Surface Mount Device, Body 6.6 x 6 mm; ComponentLink2URL: http://www.omron.com/ecb/products/pdf/en-b3s.pdf; DatasheetVersion: 10/2014; Length: 6.6 mm; Height: 4.3 mm; ComponentLink2Description: Datasheet; Mount: Surface Mount; Mounting Technology: Surface Mount; PackageReference: B3S-1000
SW4 = JS202011SCQN: SWITCH SLIDE DPDT 300MA 6V; Actuator Material: Nylon; Actuator Length: 2mm; Actuator Type: Standard; Contact Resistance: 70mR; Switch Function: On-On; Electrical Life: 5000Cycles; Voltage Rating (DC): 6V; Contact Current Rating: 300mA; Contact Plating: Silver; Throw Configuration: DPDT; REACH SVHC: No SVHC; Length: 9mm; Package Quantity: 1; Min Operating Temperature: -20°C; Contact Material: Copper Alloy; Switch Travel: 2mm; Radiation Hardening: No; Depth: 7.5mm; Packaging: Tape and Reel; Max Voltage Rating (DC): 6V; Housing Material: Nylon; Max Operating Temperature: 85°C; Current Rating: 300mA; Orientation: Vertical; Termination: Gull Wing; Flammability Rating: UL94 V-2; Lead Free: Lead Free; Mount: Surface Mount; Max Current Rating: 300mA
U1 = TM4C123GH6PMI: Tiva C Series Microcontroller, 256 KB Flash, 32 KB SRAM, 12 Bit, 12 Channels, -40 to 85 degC, 64-Pin LQFP (PM), Green (RoHS & no Sb/Br), Tape and Reel; Manufacturer: Texas Instruments; Data Memory: 32 KB; UART: 4; Max Speed: 80 MHz; I2C: 2; GPIOs: 43; ADC Channels: 12; Program Memory: 256 KB; ADC Resolution: 12 Bit; Tiva Series: Connected MCUs; Prefix: Qualified Device; Interface: I2C,USB,CAN,UART,SPI,IrDA,USART,I2S; Data Bus Width: 32b; Core Architecture: ARM; RAM Size: 32KB; Frequency: 80MHz; Oscillator Type: Internal; Number of Programmable I/O: 49; Watchdog Timer: Yes; Memory Size: 256KB; Peripherals: Brown-out Detect/Reset,POR,PWM,WDT,DMA; Max Supply Voltage: 3.63V; Min Supply Voltage: 3.15V; Operating Supply Voltage: 3.3V; ComponentLink2URL: http://www.ti.com/lit/ds/symlink/tm4c123gh6pm.pdf; Temperature Range: -40 to 85 degC; ComponentLink2Description: Datasheet; DatasheetVersion: Rev. 15741.2722; ComponentLink1URL: http://www.ti.com/; PackageVersion: 4040152/C; PartNumber: TM4C123GH6PMIR; Mounting Technology: Surface Mount; Packing: Tape and Reel; PackageDescription: 64-Pin Plastic Quad Flatpack, Body 10 x 10 mm, Pitch 0.5 mm; ComponentLink3Description: Package Specification; PackageReference: PM0064A; RoHS: TRUE; ComponentLink1Description: Manufacturer URL; ComponentLink3URL: http://www.ti.com/litv/pdf/mtqf008a; Supplier 1: Digi-Key; Manufacturer Part Number: TM4C123GH6PMIR; Stock 1: 2640; Pricing 1: 1 = 11.85000, 10 = 10.70700, 25 = 10.20880, 100 = 8.86440, 250 = 8.46600, 500 = 7.71900 (USD); Case/Package: LQFP; Number of Pins: 64; Min Operating Temperature: -40°C; Max Operating Temperature: 85°C; Packaging: Tape and Reel; Number of I/Os: 43; Number of Timers/Counters: 12; Number of ADC Channels: 12; Max Frequency: 80MHz; Memory Type: FLASH; Number of UART Channels: 4; Number of A/D Converters: 12; Number of GPIO: 43; Package Quantity: 1000; Number of Bits: 12; Radiation Hardening: No; Lead Free: Lead Free; RoHS Compliant: Yes; ComponentLink4URL: https://datasheet.ciiva.com/18628/tm4c123gh6pm-18628995.pdf?src-supplier=Digi-Key; ComponentLink4Description: https://datasheet.ciiva.com/18628/tm4c123gh6pm-18628995.pdf?src-supplier=Digi-Key; ComponentLink5URL: https://datasheet.ciiva.com/29986/tm4c123gh6pm-29986949.pdf?src-supplier=Avnet; ComponentLink5Description: https://datasheet.ciiva.com/29986/tm4c123gh6pm-29986949.pdf?src-supplier=Avnet; Supplier Part Number 1: 296-46360-1-ND
U8 = TPS73633DRBT: Single Output Low Noise LDO, 400 mA, Fixed 3.3 V Output, 1.7 to 5.5 V Input, with Reverse Current Protection, 8-pin SON (DRB), -40 to 85 degC, Green (RoHS & no Sb/Br); Manufacturer: Texas Instruments; Accuracy(%): 1; SubFamily: Single Channel LDO; Vout Adj(Min)(V): 3.3; Vin(Max)(V): 5.5; Rating: Catalog; Iout(Max)(A): 0.4; Iq(Typ)(mA): 0.3; Vdo(Typ)(mV): 75; Vin(Min)(V): 1.7; Dropout Voltage: 75mV; Output Voltage: 3.3V; Output Current: 400mA; Max Power Dissipation: 2.5W; Max Input Voltage: 5.5V; Min Input Voltage: 1.7V; Input Bias Current: 300uA; Polarity: Positive; Accuracy: 1%; Output Voltage Accuracy: 0.5%; PackageVersion: 4203482-2/K; ComponentLink3Description: Package Specification; ComponentLink4URL: Samples URL:http://www.ti.com/product/tps73633#samples; Mounting Technology: Surface Mount; ComponentLink3URL: http://www.ti.com/litv/pdf/mpds118h; PackageDescription: 8-Pin Plastic Small Outline, Body 3 x 3 mm, Pitch 0.65 mm; PackageReference: DRB0008A; Eco-Plan: Green (RoHS & no Sb/Br); PartNumber: TPS73633DRBT; ComponentLink2URL: http://www.ti.com/general/docs/lit/getliterature.tsp?genericPartNumber=TPS73633&fileType=pdf; Vout Adj(Max)(V): 3.3; ComponentLink1URL: http://www.ti.com/; ComponentLink4Description: URL Link1; Fixed Output Options(V): 3.3; DatasheetVersion: SBVS038T; ComponentLink1Description: Manufacturer URL; ComponentLink2Description: Datasheet; Supplier 1: Digi-Key; Manufacturer Part Number: TPS73633DRBT; Stock 1: 304; Pricing 1: 1 = 2.53000, 10 = 2.27500, 25 = 2.14640, 100 = 1.82880 (USD); RoHS: Yes; Case/Package: VSON; Number of Pins: 8; Min Operating Temperature: -40°C; Max Operating Temperature: 125°C; Package Quantity: 250; Packaging: Tape and Reel; Number of Outputs: 1; Max Output Current: 400mA; Number of Regulators: 1; Min Current Limit: 400mA; Power Dissipation: 2.5W; Quiescent Current: 300uA; Max Output Voltage: 3.3V; Min Output Voltage: 3.3V; Output Type: Fixed; Series: -; Radiation Hardening: No; Lead Free: Lead Free; RoHS Compliant: Yes; ComponentLink5URL: https://datasheet.ciiva.com/15111/getdatasheetpartid-48105-15111075.pdf?src-supplier=Verical; ComponentLink5Description: https://datasheet.ciiva.com/15111/getdatasheetpartid-48105-15111075.pdf?src-supplier=Verical; Supplier Part Number 1: 296-32558-1-ND
Y1 = AB26TRB-32.768KHZ-T: CRYSTAL 32.7680KHZ 12.5PF SMD; Manufacturer_Name: ABRACON; Frequency Tolerance: 20ppm; Series Resistance: 50kR; Frequency Stability: -0.034ppm; Datasheet Link: http://www.abracon.com/Resonators/AB26TRB.pdf; Manufacturer_Part_Number: AB26TRB-32.768KHZ-T; Mouser Part Number: 815-AB26TRB-32.76KHZ; Mouser Price/Stock: https://www.mouser.com/Search/Refine.aspx?Keyword=815-AB26TRB-32.76KHZ; Supplier 1: Avnet; Supplier Part Number 1: AB26TRB-32.768KHZ-T; Supplier 2: Digi-Key; Manufacturer: Abracon; Manufacturer Part Number: AB26TRB-32.768KHZ-T; Stock 2: 97662; Pricing 2: 1 = 0.52000, 10 = 0.43200, 50 = 0.38880, 100 = 0.34560, 500 = 0.32832, 1000 = 0.27648 (USD); RoHS: Yes; Mount: Surface Mount; Case/Package: Radial; Number of Pins: 2; Min Operating Temperature: -40°C; Max Operating Temperature: 85°C; Frequency: 32.768kHz; Load Capacitance: 12.5pF; Packaging: Tape and Reel; ESR (Equivalent Series Resistance): 50kR; Package Quantity: 500; Tolerance: 20ppm; Termination: Radial; Series: AB26TRB; Operating Frequency: 32.768 kHz; Length: 6mm; Height: 0.075inch; Lead Pitch: 2.54mm; Depth: 1.9mm; REACH SVHC: No SVHC; Lead Free: Lead Free; ComponentLink1URL: https://datasheet.ciiva.com/4945/ab26tr-30941-4945140.pdf?src-supplier=Mouser; ComponentLink1Description: https://datasheet.ciiva.com/4945/ab26tr-30941-4945140.pdf?src-supplier=Mouser; ComponentLink2URL: https://datasheet.ciiva.com/1357/ab26tr-1357201.pdf?src-supplier=Element14; ComponentLink2Description: https://datasheet.ciiva.com/1357/ab26tr-1357201.pdf?src-supplier=Element14; ComponentLink3URL: https://datasheet.ciiva.com/854/ab26trb-854381.pdf?src-supplier=Digi-Key; ComponentLink3Description: https://datasheet.ciiva.com/854/ab26trb-854381.pdf?src-supplier=Digi-Key; ComponentLink4URL: https://datasheet.ciiva.com/854/ab26trb-854382.pdf?src-supplier=Digi-Key; ComponentLink4Description: https://datasheet.ciiva.com/854/ab26trb-854382.pdf?src-supplier=Digi-Key; ComponentLink5URL: https://datasheet.ciiva.com/854/ab26trb-854383.pdf?src-supplier=Digi-Key; ComponentLink5Description: https://datasheet.ciiva.com/854/ab26trb-854383.pdf?src-supplier=Digi-Key; ComponentLink6URL: https://datasheet.ciiva.com/3174/ab26trb-3174233.pdf?src-supplier=Avnet; ComponentLink6Description: https://datasheet.ciiva.com/3174/ab26trb-3174233.pdf?src-supplier=Avnet; ComponentLink7URL: https://datasheet.ciiva.com/16215/ab26trb-16215317.pdf?src-supplier=Future+Electronics; ComponentLink7Description: https://datasheet.ciiva.com/16215/ab26trb-16215317.pdf?src-supplier=Future+Electronics; ComponentLink8URL: https://datasheet.ciiva.com/28508/270658-28508373.pdf?src-supplier=Element14; ComponentLink8Description: https://datasheet.ciiva.com/28508/270658-28508373.pdf?src-supplier=Element14; Supplier Part Number 2: 535-9033-1-ND
Y2 = NX5032GA-16.000000MHZ: CRYSTAL 16.0000MHZ 8PF SMD; Manufacturer_Name: NDK; Manufacturer_Part_Number: NX5032GA-16.000000MHZ-LN-CD-1; Frequency: 16MHz; Frequency Tolerance: 50ppm; ESR (Equivalent Series Resistance): 120R; Datasheet Link: https://media.digikey.com/pdf/Data%20Sheets/NDK%20PDFs/NX5032GA.pdf; Height: 1.5mm; Supplier 1: Digi-Key; Supplier Part Number 1: 644-1037-1-ND; Manufacturer: NDK; Manufacturer Part Number: NX5032GA-16.000000MHZ-LN-CD-1; Stock 1: 25488; Pricing 1: 1 = 0.60000, 10 = 0.50000, 50 = 0.45000, 100 = 0.40000, 500 = 0.38000 (USD); RoHS: Yes; Mount: Surface Mount; Case/Package: SMD/SMT; Number of Pins: 2; Min Operating Temperature: -10°C; Max Operating Temperature: 70°C; Package Quantity: 1000; Load Capacitance: 8pF; Packaging: Tape and Reel; Frequency Stability: 50ppm; Series: NX5032GA; Length: 0.197inch; Width: 0.126inch; ComponentLink1URL: https://datasheet.ciiva.com/862/nx5032ga-862731.pdf?src-supplier=Digi-Key; ComponentLink1Description: https://datasheet.ciiva.com/862/nx5032ga-862731.pdf?src-supplier=Digi-Key; ComponentLink2URL: https://datasheet.ciiva.com/862/nx5032ga-862732.pdf?src-supplier=Digi-Key; ComponentLink2Description: https://datasheet.ciiva.com/862/nx5032ga-862732.pdf?src-supplier=Digi-Key; ComponentLink3URL: https://datasheet.ciiva.com/862/nx5032ga-862733.pdf?src-supplier=Digi-Key; ComponentLink3Description: https://datasheet.ciiva.com/862/nx5032ga-862733.pdf?src-supplier=Digi-Key